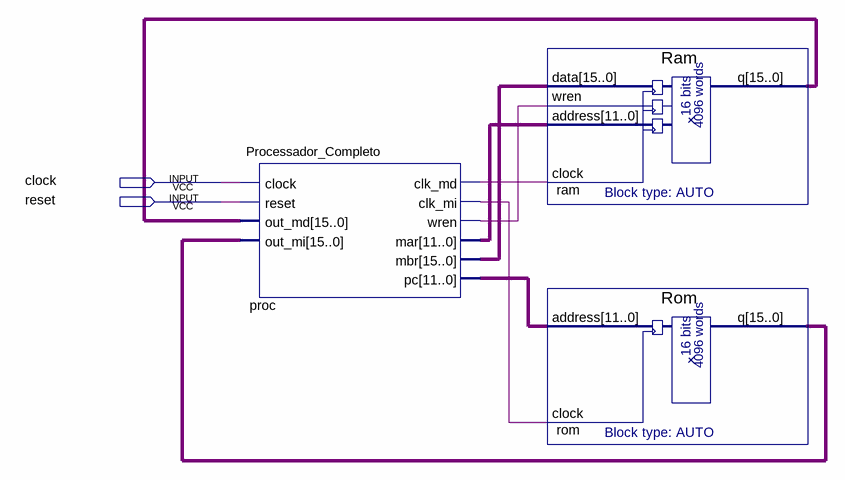
[diagram p0: schematic sheet]
// Quartus schematic Harvard_Processor.bdf as structural Verilog: 3 symbols, 2 pins
module Harvard_Processor (
  input  clock,
  input  reset
);

  wire proc_clk_md, proc_clk_mi, proc_wren;
  wire [11:0] proc_mar, proc_pc;
  wire [15:0] proc_mbr, ram_q, rom_q;

  Processador_Completo proc (
    .clock(clock), .reset(reset), .out_md(ram_q), .out_mi(rom_q), .clk_md(proc_clk_md), .clk_mi(proc_clk_mi),
    .wren(proc_wren), .mar(proc_mar), .mbr(proc_mbr), .pc(proc_pc));
  Ram ram (.data(proc_mbr), .wren(proc_wren), .address(proc_mar), .clock(proc_clk_md), .q(ram_q));
  Rom rom (.address(proc_pc), .clock(proc_clk_mi), .q(rom_q));
endmodule
